# Altium schematic sheet matrix.SchDoc
size A; SheetNumber: 1; SheetTotal: 2
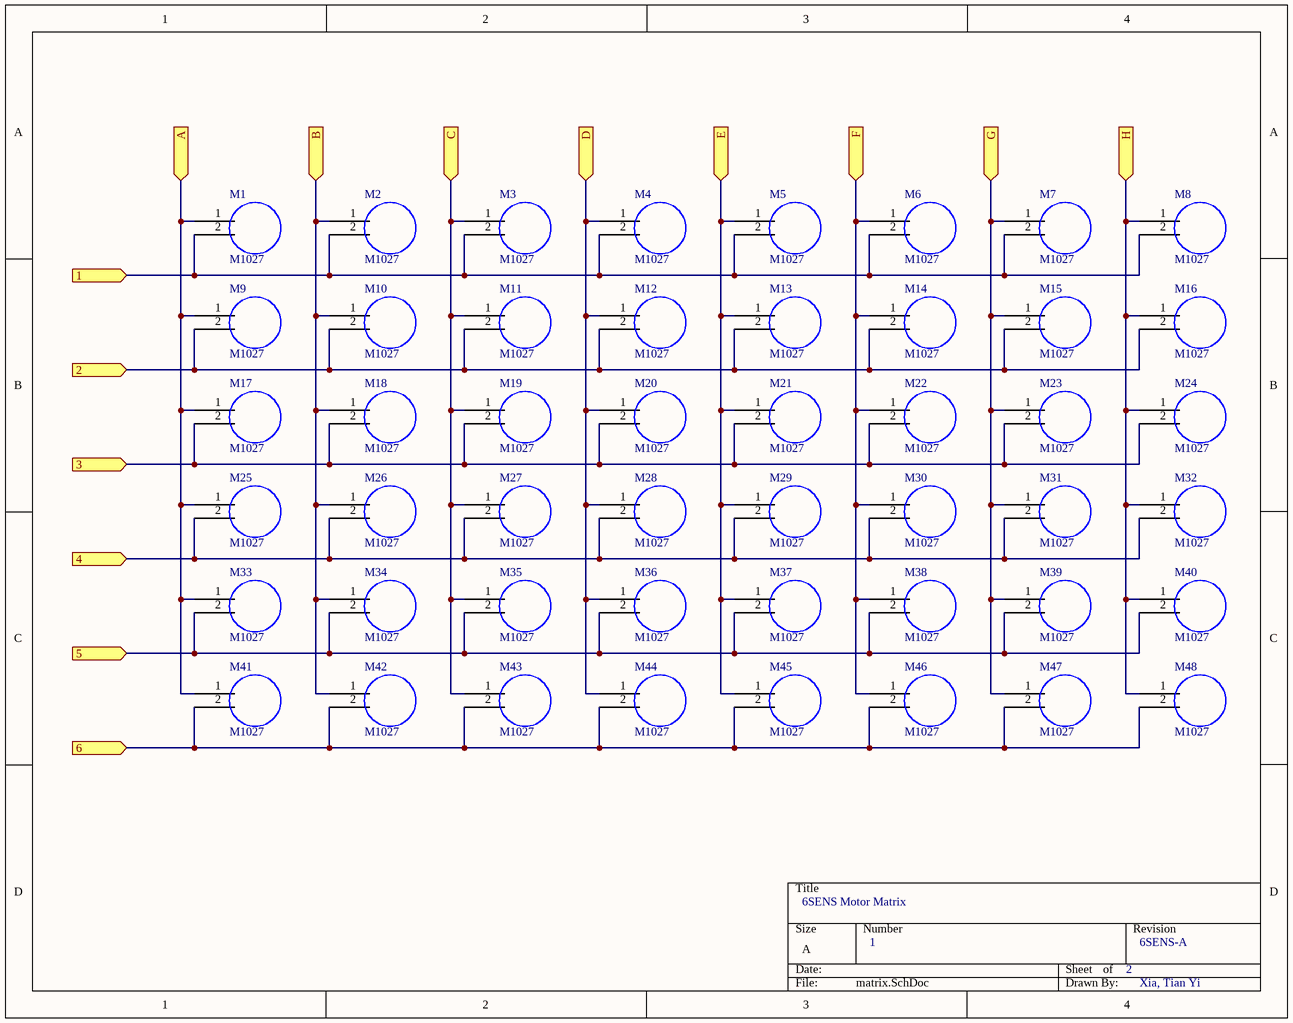
[diagram p0: matrix.SchDoc]

## Parts
M1  M1027  [M1027]
M2  M1027  [M1027]
M3  M1027  [M1027]
M4  M1027  [M1027]
M5  M1027  [M1027]
M6  M1027  [M1027]
M7  M1027  [M1027]
M8  M1027  [M1027]
M9  M1027  [M1027]
M10  M1027  [M1027]
M11  M1027  [M1027]
M12  M1027  [M1027]
M13  M1027  [M1027]
M14  M1027  [M1027]
M15  M1027  [M1027]
M16  M1027  [M1027]
M17  M1027  [M1027]
M18  M1027  [M1027]
M19  M1027  [M1027]
M20  M1027  [M1027]
M21  M1027  [M1027]
M22  M1027  [M1027]
M23  M1027  [M1027]
M24  M1027  [M1027]
M25  M1027  [M1027]
M26  M1027  [M1027]
M27  M1027  [M1027]
M28  M1027  [M1027]
M29  M1027  [M1027]
M30  M1027  [M1027]
M31  M1027  [M1027]
M32  M1027  [M1027]
M33  M1027  [M1027]
M34  M1027  [M1027]
M35  M1027  [M1027]
M36  M1027  [M1027]
M37  M1027  [M1027]
M38  M1027  [M1027]
M39  M1027  [M1027]
M40  M1027  [M1027]
M41  M1027  [M1027]
M42  M1027  [M1027]
M43  M1027  [M1027]
M44  M1027  [M1027]
M45  M1027  [M1027]
M46  M1027  [M1027]
M47  M1027  [M1027]
M48  M1027  [M1027]

## Ports
1 (in), 2 (in), 3 (in), 4 (in), 5 (in), 6 (in), A (in), B (in), C (in), D (in), E (in), F (in), G (in), H (in)

## Nets
1: M1.2 M2.2 M3.2 M4.2 M5.2 M6.2 M7.2 M8.2 ; port 1
2: M9.2 M10.2 M11.2 M12.2 M13.2 M14.2 M15.2 M16.2 ; port 2
3: M17.2 M18.2 M19.2 M20.2 M21.2 M22.2 M23.2 M24.2 ; port 3
4: M25.2 M26.2 M27.2 M28.2 M29.2 M30.2 M31.2 M32.2 ; port 4
5: M33.2 M34.2 M35.2 M36.2 M37.2 M38.2 M39.2 M40.2 ; port 5
6: M41.2 M42.2 M43.2 M44.2 M45.2 M46.2 M47.2 M48.2 ; port 6
A: M1.1 M9.1 M17.1 M25.1 M33.1 M41.1 ; port A
B: M2.1 M10.1 M18.1 M26.1 M34.1 M42.1 ; port B
C: M3.1 M11.1 M19.1 M27.1 M35.1 M43.1 ; port C
D: M4.1 M12.1 M20.1 M28.1 M36.1 M44.1 ; port D
E: M5.1 M13.1 M21.1 M29.1 M37.1 M45.1 ; port E
F: M6.1 M14.1 M22.1 M30.1 M38.1 M46.1 ; port F
G: M7.1 M15.1 M23.1 M31.1 M39.1 M47.1 ; port G
H: M8.1 M16.1 M24.1 M32.1 M40.1 M48.1 ; port H

## Notes on the sheet
- 6SENS Motor Matrix
- 1
- 2
- 6SENS-A
- Xia, Tian Yi

## Library data of the parts
M1-M48 = M1027: 10mm x 2.7mm vibration motor